# Altium project Sayma_AMC.PrjPcb (part 15 of 18)

## Sheet FPGA_Decoupling.SchDoc: Sayma AMC
size 420 x 297 mm; $$Internal___BlkDate: 0:12:25_2-9-18; $$Internal_NAME_PLACEHOLDER: a3sheet; $$Internal_Resolution: 00001mm; $$NotCommonProperty_@NAME: FPGA_XCKU040FFVA1156; $$NotCommonProperty_@PRINTORDER: 24; $$NotCommonProperty_@SHEET: FPGA Decoupling; $$NotCommonProperty_@SHEETTOTAL: 30; CmpIndex: 996; Drawing Author: G.Kasprowicz; Drawing Number: Sayma AMC; Drawing Project: AMC FMC Carrier Board; Drawing Revision: 2.0; SymIndex: 2141; CheckedBy: P.Kulik,T.Przywozki,W.Ruclo; Author: G.Kasprowicz; CompanyName: WUT ISE; DrawnBy: G.Kasprowicz; Organization: WUT ISE; Address1: PW ISE; Address2: Nowowiejska 15/19 00-665 Warsaw; Address3: gkasprow@gmail.com; DocumentNumber: 30; Revision: 2; SheetNumber: 30; SheetTotal: 32; ModifiedBy: -; CheckedDate: -; Title2: FPGA Decoupling; DivGrp: WUT ISE; Designer: G.Kasprowicz; ModifiedDate: -; ProjectName: Sensor Box
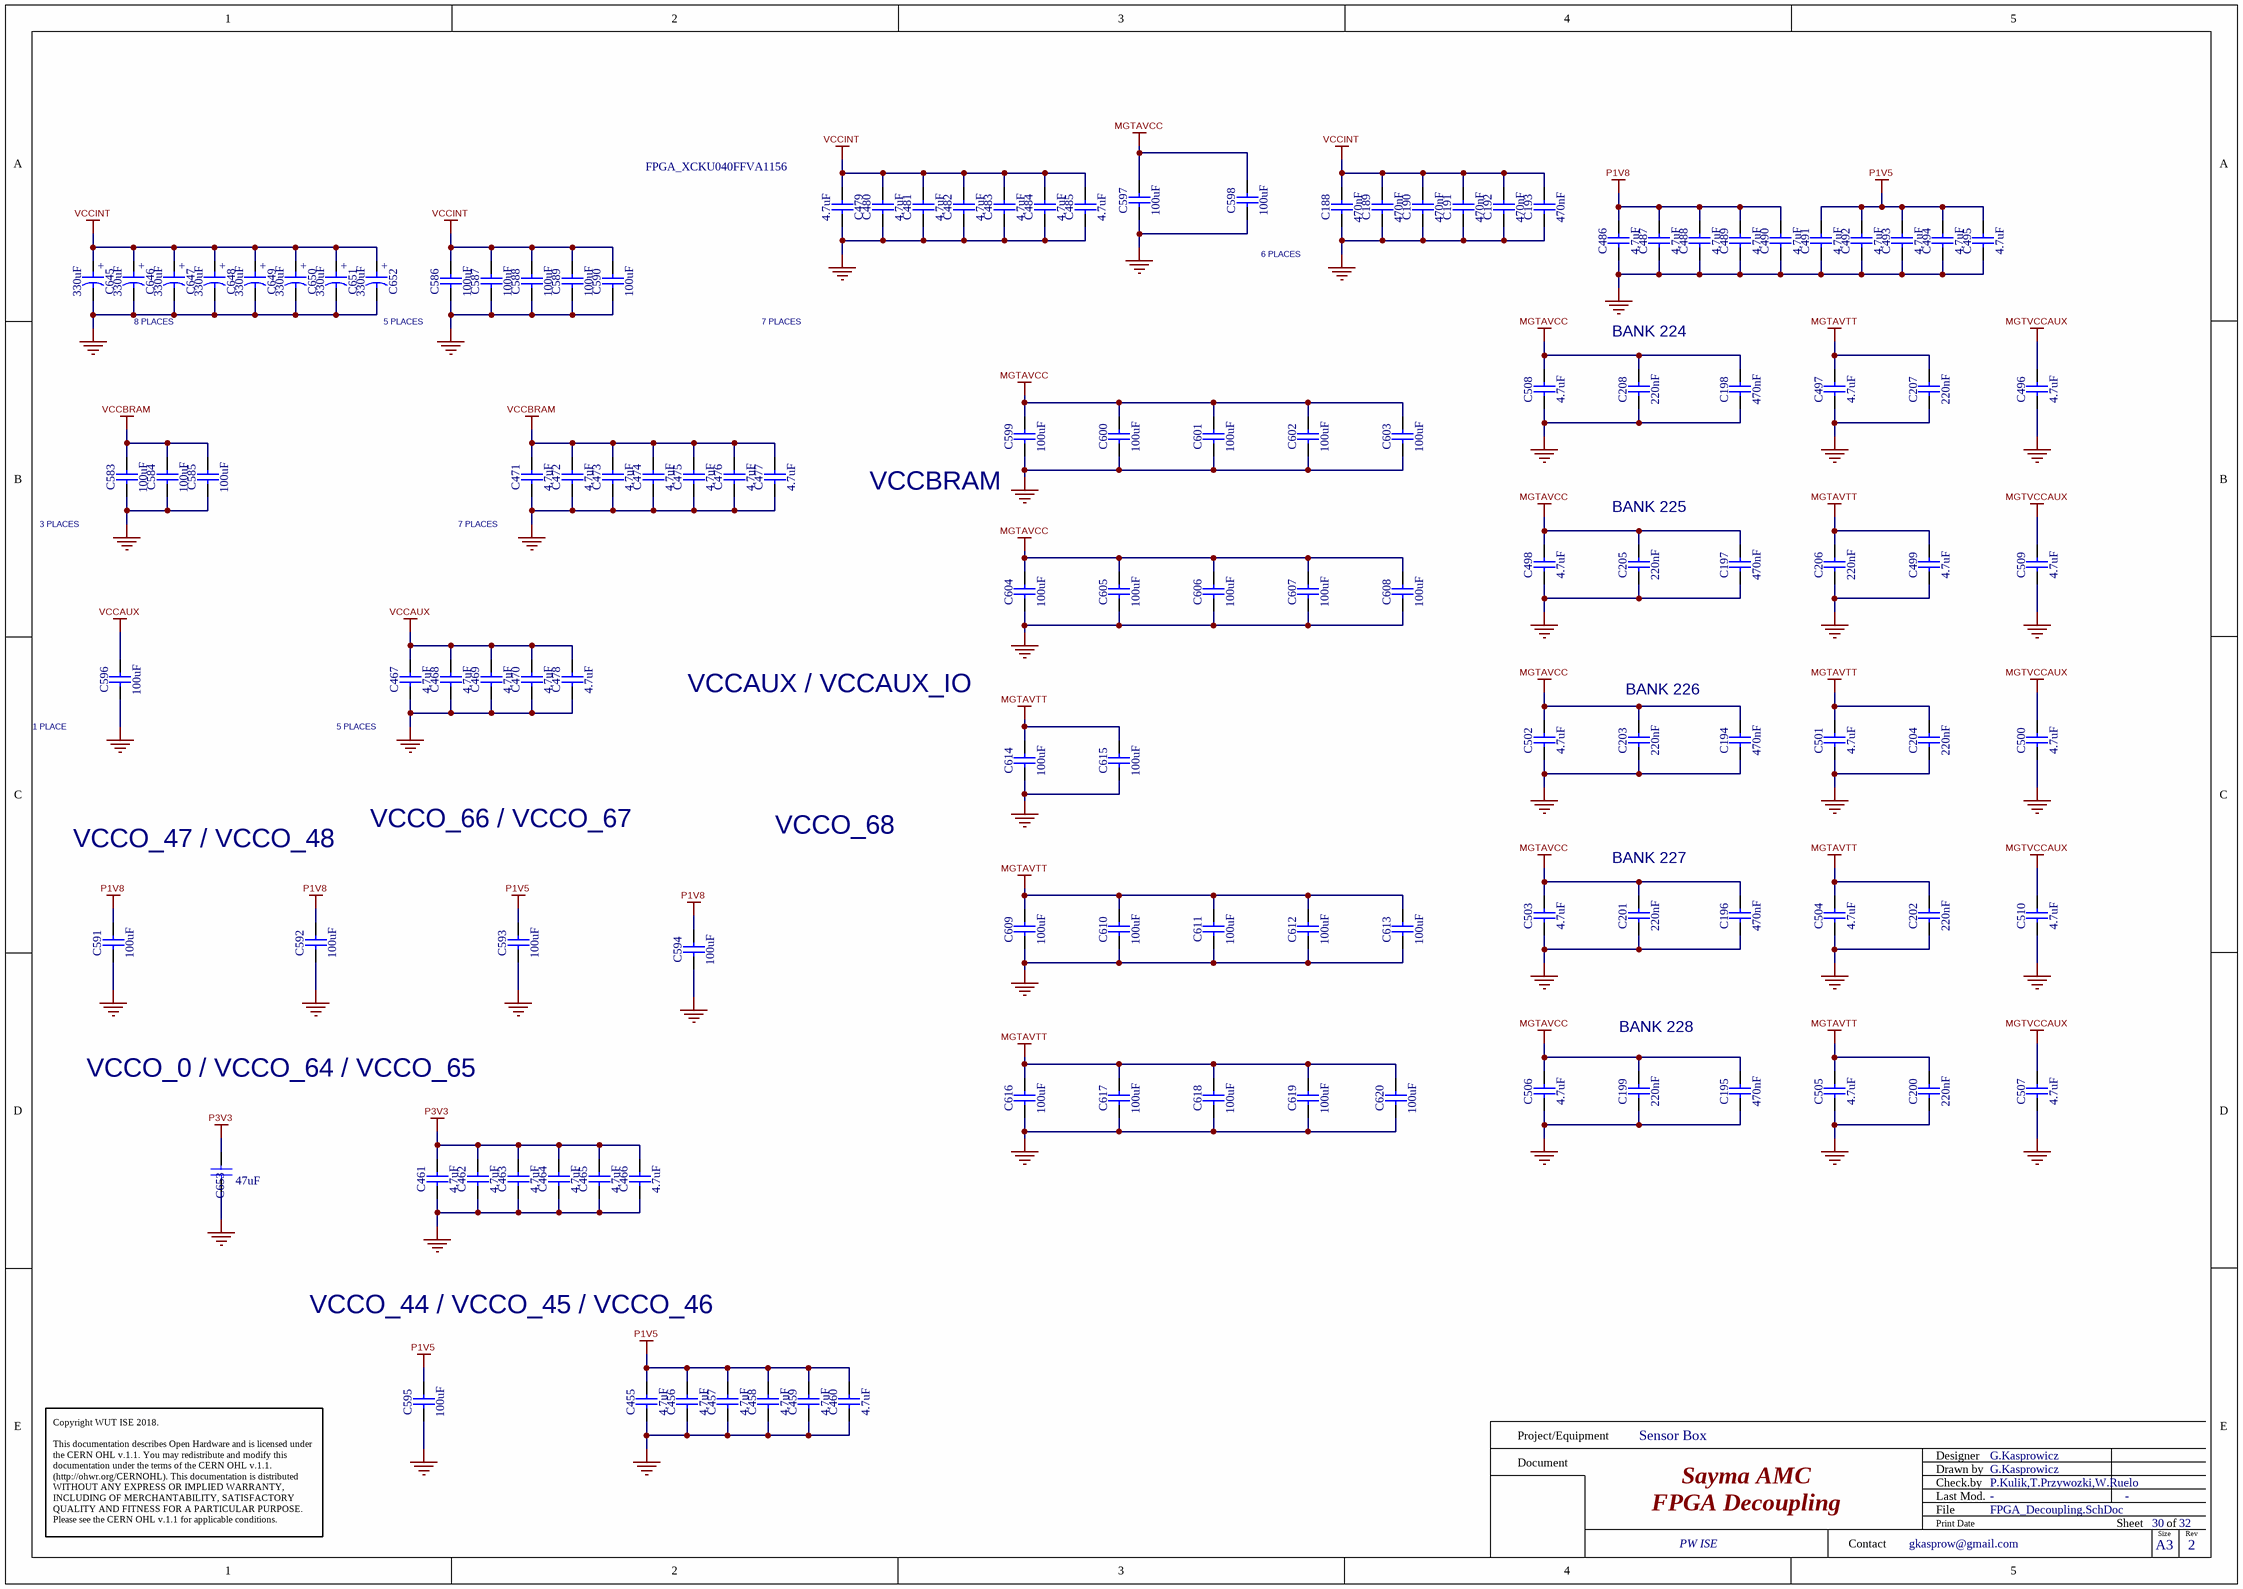
[diagram p26: FPGA_Decoupling.SchDoc]

### Parts
C188  470nF  [CAPC0603X33N]
C189  470nF  [CAPC0603X33N]
C190  470nF  [CAPC0603X33N]
C191  470nF  [CAPC0603X33N]
C192  470nF  [CAPC0603X33N]
C193  470nF  [CAPC0603X33N]
C194  470nF  [CAPC0603X33N]
C195  470nF  [CAPC0603X33N]
C196  470nF  [CAPC0603X33N]
C197  470nF  [CAPC0603X33N]
C198  470nF  [CAPC0603X33N]
C199  220nF  [CAPC0603X33N]
C200  220nF  [CAPC0603X33N]
C201  220nF  [CAPC0603X33N]
C202  220nF  [CAPC0603X33N]
C203  220nF  [CAPC0603X33N]
C204  220nF  [CAPC0603X33N]
C205  220nF  [CAPC0603X33N]
C206  220nF  [CAPC0603X33N]
C207  220nF  [CAPC0603X33N]
C208  220nF  [CAPC0603X33N]
C455  4.7uF  [CAPC1005X55N]
C456  4.7uF  [CAPC1005X55N]
C457  4.7uF  [CAPC1005X55N]
C458  4.7uF  [CAPC1005X55N]
C459  4.7uF  [CAPC1005X55N]
C460  4.7uF  [CAPC1005X55N]
C461  4.7uF  [CAPC1005X55N]
C462  4.7uF  [CAPC1005X55N]
C463  4.7uF  [CAPC1005X55N]
C464  4.7uF  [CAPC1005X55N]
C465  4.7uF  [CAPC1005X55N]
C466  4.7uF  [CAPC1005X55N]
C467  4.7uF  [CAPC1005X55N]
C468  4.7uF  [CAPC1005X55N]
C469  4.7uF  [CAPC1005X55N]
C470  4.7uF  [CAPC1005X55N]
C471  4.7uF  [CAPC1005X55N]
C472  4.7uF  [CAPC1005X55N]
C473  4.7uF  [CAPC1005X55N]
C474  4.7uF  [CAPC1005X55N]
C475  4.7uF  [CAPC1005X55N]
C476  4.7uF  [CAPC1005X55N]
C477  4.7uF  [CAPC1005X55N]
C478  4.7uF  [CAPC1005X55N]
C479  4.7uF  [CAPC1005X55N]
C480  4.7uF  [CAPC1005X55N]
C481  4.7uF  [CAPC1005X55N]
C482  4.7uF  [CAPC1005X55N]
C483  4.7uF  [CAPC1005X55N]
C484  4.7uF  [CAPC1005X55N]
C485  4.7uF  [CAPC1005X55N]
C486  4.7uF  [CAPC1005X55N]
C487  4.7uF  [CAPC1005X55N]
C488  4.7uF  [CAPC1005X55N]
C489  4.7uF  [CAPC1005X55N]
C490  4.7uF  [CAPC1005X55N]
C491  4.7uF  [CAPC1005X55N]
C492  4.7uF  [CAPC1005X55N]
C493  4.7uF  [CAPC1005X55N]
C494  4.7uF  [CAPC1005X55N]
C495  4.7uF  [CAPC1005X55N]
C496  4.7uF  [CAPC1005X55N]
C497  4.7uF  [CAPC1005X55N]
C498  4.7uF  [CAPC1005X55N]
C499  4.7uF  [CAPC1005X55N]
C500  4.7uF  [CAPC1005X55N]
C501  4.7uF  [CAPC1005X55N]
C502  4.7uF  [CAPC1005X55N]
C503  4.7uF  [CAPC1005X55N]
C504  4.7uF  [CAPC1005X55N]
C505  4.7uF  [CAPC1005X55N]
C506  4.7uF  [CAPC1005X55N]
C507  4.7uF  [CAPC1005X55N]
C508  4.7uF  [CAPC1005X55N]
C509  4.7uF  [CAPC1005X55N]
C510  4.7uF  [CAPC1005X55N]
C583  100uF  [CAPC3216X180N]
C584  100uF  [CAPC3216X180N]
C585  100uF  [CAPC3216X180N]
C586  100uF  [CAPC3216X180N]
C587  100uF  [CAPC3216X180N]
C588  100uF  [CAPC3216X180N]
C589  100uF  [CAPC3216X180N]
C590  100uF  [CAPC3216X180N]
C591  100uF  [CAPC3216X180N]
C592  100uF  [CAPC3216X180N]
C593  100uF  [CAPC3216X180N]
C594  100uF  [CAPC3216X180N]
C595  100uF  [CAPC3216X180N]
C596  100uF  [CAPC3216X180N]
C597  100uF  [CAPC3216X180N]
C598  100uF  [CAPC3216X180N]
C599  100uF  [CAPC3216X180N]
C600  100uF  [CAPC3216X180N]
C601  100uF  [CAPC3216X180N]
C602  100uF  [CAPC3216X180N]
C603  100uF  [CAPC3216X180N]
C604  100uF  [CAPC3216X180N]
C605  100uF  [CAPC3216X180N]
C606  100uF  [CAPC3216X180N]
C607  100uF  [CAPC3216X180N]
C608  100uF  [CAPC3216X180N]
C609  100uF  [CAPC3216X180N]
C610  100uF  [CAPC3216X180N]
C611  100uF  [CAPC3216X180N]
C612  100uF  [CAPC3216X180N]
C613  100uF  [CAPC3216X180N]
C614  100uF  [CAPC3216X180N]
C615  100uF  [CAPC3216X180N]
C616  100uF  [CAPC3216X180N]
C617  100uF  [CAPC3216X180N]
C618  100uF  [CAPC3216X180N]
C619  100uF  [CAPC3216X180N]
C620  100uF  [CAPC3216X180N]
C645  330uF  [CAPMP3528X210N]
C646  330uF  [CAPMP3528X210N]
C647  330uF  [CAPMP3528X210N]
C648  330uF  [CAPMP3528X210N]
C649  330uF  [CAPMP3528X210N]
C650  330uF  [CAPMP3528X210N]
C651  330uF  [CAPMP3528X210N]
C652  330uF  [CAPMP3528X210N]
C653  47uF  [CAPC3225X270N]

### Nets
GND: C188.1 C189.1 C190.1 C191.1 C192.1 C193.1 C194.1 C195.1 C196.1 C197.1 C198.1 C199.1 C200.1 C201.1 C202.1 C203.1 C204.1 C205.1 C206.1 C207.1 C208.1 C455.1 C456.1 C457.1 C458.1 C459.1 C460.1 C461.1 C462.1 C463.1 C464.1 C465.1 C466.1 C467.1 C468.1 C469.1 C470.1 C471.1 C472.1 C473.1 C474.1 C475.1 C476.1 C477.1 C478.1 C479.1 C480.1 C481.1 C482.1 C483.1 C484.1 C485.1 C486.1 C487.1 C488.1 C489.1 C490.1 C491.1 C492.1 C493.1 C494.1 C495.1 C496.1 C497.1 C498.1 C499.1 C500.1 C501.1 C502.1 C503.1 C504.1 C505.1 C506.1 C507.1 C508.1 C509.1 C510.1 C583.1 C584.1 C585.1 C586.1 C587.1 C588.1 C589.1 C590.1 C591.1 C592.1 C593.1 C594.1 C595.1 C596.1 C597.1 C598.1 C599.1 C600.1 C601.1 C602.1 C603.1 C604.1 C605.1 C606.1 C607.1 C608.1 C609.1 C610.1 C611.1 C612.1 C613.1 C614.1 C615.1 C616.1 C617.1 C618.1 C619.1 C620.1 C645.2 C646.2 C647.2 C648.2 C649.2 C650.2 C651.2 C652.2 C653.1
MGTAVCC: C194.2 C195.2 C196.2 C197.2 C198.2 C199.2 C201.2 C203.2 C205.2 C208.2 C498.2 C502.2 C503.2 C506.2 C508.2 C597.2 C598.2 C599.2 C600.2 C601.2 C602.2 C603.2 C604.2 C605.2 C606.2 C607.2 C608.2
MGTAVTT: C200.2 C202.2 C204.2 C206.2 C207.2 C497.2 C499.2 C501.2 C504.2 C505.2 C609.2 C610.2 C611.2 C612.2 C613.2 C614.2 C615.2 C616.2 C617.2 C618.2 C619.2 C620.2
MGTVCCAUX: C496.2 C500.2 C507.2 C509.2 C510.2
P1V5: C455.2 C456.2 C457.2 C458.2 C459.2 C460.2 C491.2 C492.2 C493.2 C494.2 C495.2 C593.2 C595.2
P1V8: C486.2 C487.2 C488.2 C489.2 C490.2 C591.2 C592.2 C594.2
P3V3: C461.2 C462.2 C463.2 C464.2 C465.2 C466.2 C653.2
VCCAUX: C467.2 C468.2 C469.2 C470.2 C478.2 C596.2
VCCBRAM: C471.2 C472.2 C473.2 C474.2 C475.2 C476.2 C477.2 C583.2 C584.2 C585.2
VCCINT: C188.2 C189.2 C190.2 C191.2 C192.2 C193.2 C479.2 C480.2 C481.2 C482.2 C483.2 C484.2 C485.2 C586.2 C587.2 C588.2 C589.2 C590.2 C645.1 C646.1 C647.1 C648.1 C649.1 C650.1 C651.1 C652.1

### Notes on the sheet
- 6 PLACES
- 8 PLACES
- 5 PLACES
- 7 PLACES
- (near C208) BANK 224
- 3 PLACES
- VCCBRAM
- (near C205) BANK 225
- 1 PLACE
- VCCAUX / VCCAUX_IO
- (near C203) BANK 226
- VCCO_47 / VCCO_48
- VCCO_66 / VCCO_67
- VCCO_68
- (near C201) BANK 227
- (near C199) BANK 228
- VCCO_0 / VCCO_64 / VCCO_65
- VCCO_44 / VCCO_45 / VCCO_46
- Project/Equipment
- Document
- Designer
- Drawn by
- Check.by
- Copyright WUT ISE 2018.
  This documentation describes Open Hardware and is licensed under the CERN OHL v.1.1. You may redistribute and modify this documentation under the terms of the CERN OHL v.1.1. (http://ohwr.org/CERNOHL). This documentation is distributed WITHOUT ANY EXPRESS OR IMPLIED WARRANTY, INCLUDING OF MERCHANTABILITY, SATISFACTORY QUALITY AND FITNESS FOR A PARTICULAR PURPOSE. Please see the CERN OHL v.1.1 for applicable conditions.
- Contact
- File
- Last Mod.
- Print Date
- Sheet
- Size
- A3
- of
- Rev
- (in symbol CTE3528-21_330UF_2.5V_20%_LESR0015_KEMET_T520) +

### Library data of the parts
C188-C198 = CC0201_470NF_4V_20%_X5R: Non-polarised capacitor; Manufacturer: GENERIC; Part Description: SMD Multilayer Chip Ceramic Capacitor; Manufacturer1 Part Number: AMK063BJ474MP-F; Tolerance: ±20%; Voltage: 4V; TC: X5R; Manufacturer Part Number: CC0201_470NF_4V_20%_X5R; Part Number: CC0201_470NF_4V_20%_X5R; Value: 470nF; Component Kind: Standard; Component Type: Standard; Pin Count: 2; Status: Not Recommended; Case: 0201; Mounted: Yes; Socket: No; SMD: Yes; Sense: No; Manufacturer1 Example: TAIYO YUDEN; Manufacturer1 ComponentHeight: 0.33mm; HelpURL: \\cern.ch\dfs\Applications\Altium\Datasheets\CC0201_X5R_TAIYO-YUDEN_STANDARD-CLASS2.pdf; Author: CERN DEM JLC; CreateDate: 27.05.2010; LatestRevisionDate: 27.05.2010
C199-C208 = CC0201_220NF_6.3V_20%_X5R: Non-polarised capacitor; Manufacturer: GENERIC; Part Description: SMD Multilayer Chip Ceramic Capacitor; Manufacturer1 Part Number: JMK063BJ224MP-F; Tolerance: ±20%; Voltage: 6.3V; TC: X5R; Manufacturer Part Number: CC0201_220NF_6.3V_20%_X5R; Part Number: CC0201_220NF_6.3V_20%_X5R; Value: 220nF; Component Kind: Standard; Component Type: Standard; Pin Count: 2; Status: Not Recommended; Case: 0201; Mounted: Yes; Socket: No; SMD: Yes; Sense: No; Manufacturer1 Example: TAIYO YUDEN; Manufacturer1 ComponentHeight: 0.33mm; HelpURL: \\cern.ch\dfs\Applications\Altium\Datasheets\CC0201_X5R_TAIYO-YUDEN_STANDARD-CLASS2.pdf; Author: CERN DEM JLC; CreateDate: 27.05.2010; LatestRevisionDate: 27.05.2010
C455-C510 = CC0402_4.7UF_6.3V_20%_X5R: Non-polarised capacitor; Manufacturer: GENERIC; Part Description: SMD Multilayer Chip Ceramic Capacitor; Manufacturer1 Part Number: C1005X5R0J475M050BC; Tolerance: ±20%; Voltage: 6.3V; TC: X5R; Manufacturer Part Number: CC0402_4.7UF_6.3V_20%_X5R; Part Number: CC0402_4.7UF_6.3V_20%_X5R; Value: 4.7uF; Component Kind: Standard; Component Type: Standard; Pin Count: 2; Status: Preferred; Case: 0402; Mounted: Yes; Socket: No; SMD: Yes; Sense: No; Manufacturer1 Example: TDK; Manufacturer1 ComponentHeight: 0.65mm; HelpURL: \\cern.ch\dfs\Applications\Altium\Datasheets\CC0402_X5R_TDK_C.pdf; Author: CERN DEM JLC; CreateDate: 03.03.2015; LatestRevisionDate: 03.03.2015
C583-C620 = CC1206_100UF_6.3V_20%_X5R: Non-polarised capacitor; Manufacturer: GENERIC; Part Description: SMD Multilayer Chip Ceramic Capacitor; Manufacturer1 Part Number: C1206C107M9PACTU; Tolerance: ±10%; Voltage: 6.3V; TC: X5R; Manufacturer Part Number: CC1206_100UF_6.3V_20%_X5R; Part Number: CC1206_100UF_6.3V_20%_X5R; Value: 100uF; Component Kind: Standard; Component Type: Standard; Pin Count: 2; Status: None; Case: 1206; Mounted: Yes; Socket: No; SMD: Yes; Sense: No; Manufacturer1 Example: KEMET; Manufacturer1 ComponentHeight: 1.8mm; HelpURL: \\cern.ch\dfs\Applications\Altium\Datasheets\CC1206_X5R_KEMET.pdf; Author: CERN DEM JLC; CreateDate: 26.09.2012; LatestRevisionDate: 26.09.2012
C645-C652 = CTE3528-21_330UF_2.5V_20%_LESR0015_KEMET_T520: Polarised capacitor; Manufacturer Part Number: T520B337M2R5ATE015; Manufacturer: KEMET; Part Description: Low ESR 0R015 Tantalum Chip Capacitor; Tolerance: ±20%; Voltage: 2.5V; Part Number: CTE3528-21_330UF_2.5V_20%_LESR0015_KEMET_T520; Value: 330uF; Component Kind: Standard; Component Type: Standard; Pin Count: 2; Status: None; Case: B; Mounted: Yes; Socket: No; SMD: Yes; Sense: No; ComponentHeight: 2.1mm; HelpURL: \\cern.ch\dfs\Applications\Altium\Datasheets\CTE-LESR_KEMET_T520.pdf; Author: CERN DEM JLC; CreateDate: 07.03.2012; LatestRevisionDate: 01.09.2014
C653 = CAPC3225X270N: $$NotCommonProperty_General Part Number: CC1210_47UF_6.3V_10%_X5R; $$NotCommonProperty_Manufacturer1 Example: AVX; $$NotCommonProperty_Manufacturer1 Part Number: 12106D476KAT2A; Manufacturer: GENERIC; Part Description: SMD Multilayer Chip Ceramic Capacitor; Part Name: Capacitor - non polarized CAPC3225X270N; $$Internal_Resolution: 00001mm; $$NotCommonProperty_Case: 1210; $$NotCommonProperty_Pin Count: 2; $$NotCommonProperty_SMD: Yes; $$NotCommonProperty_Status: Preferred; $$NotCommonProperty_TC: X5R; $$NotCommonProperty_Voltage: 6.3V; CmpIndex: 876; DXDB_LIBNAME: Capacitors SMD; Ref Designator: C653; SymIndex: 331; Tolerance: ±10%; Cell Name: CAPC3225X270N; Manufacturer Part Number: CC1210_47UF_6.3V_10%_X5R; Part Number: Capacitor - non polarized CAPC3225X270N; Value: 47uF; Orientation: 1 = 1

## Sheet FPGA_GND_NC.SchDoc: Sayma AMC
size 420 x 297 mm; $$Internal___BlkDate: 0:12:25_2-9-18; $$Internal_NAME_PLACEHOLDER: a3sheet; $$Internal_Resolution: 00001mm; $$NotCommonProperty_@NAME: FPGA_XCKU040FFVA1156; $$NotCommonProperty_@PRINTORDER: 23; $$NotCommonProperty_@SHEET: FPGA GND NC; $$NotCommonProperty_@SHEETTOTAL: 30; CmpIndex: 995; Drawing Author: G.Kasprowicz; Drawing Number: Sayma AMC; Drawing Project: AMC FMC Carrier Board; Drawing Revision: 2.0; SymIndex: 2141; CheckedBy: P.Kulik,T.Przywozki,W.Ruclo; Author: G.Kasprowicz; CompanyName: WUT ISE; DrawnBy: G.Kasprowicz; Organization: WUT ISE; Address1: PW ISE; Address2: Nowowiejska 15/19 00-665 Warsaw; Address3: gkasprow@gmail.com; DocumentNumber: 31; Revision: 2; SheetNumber: 31; SheetTotal: 32; ModifiedBy: -; CheckedDate: -; Title2: FPGA power ports; DivGrp: WUT ISE; Designer: G.Kasprowicz; ModifiedDate: -; ProjectName: Sensor Box
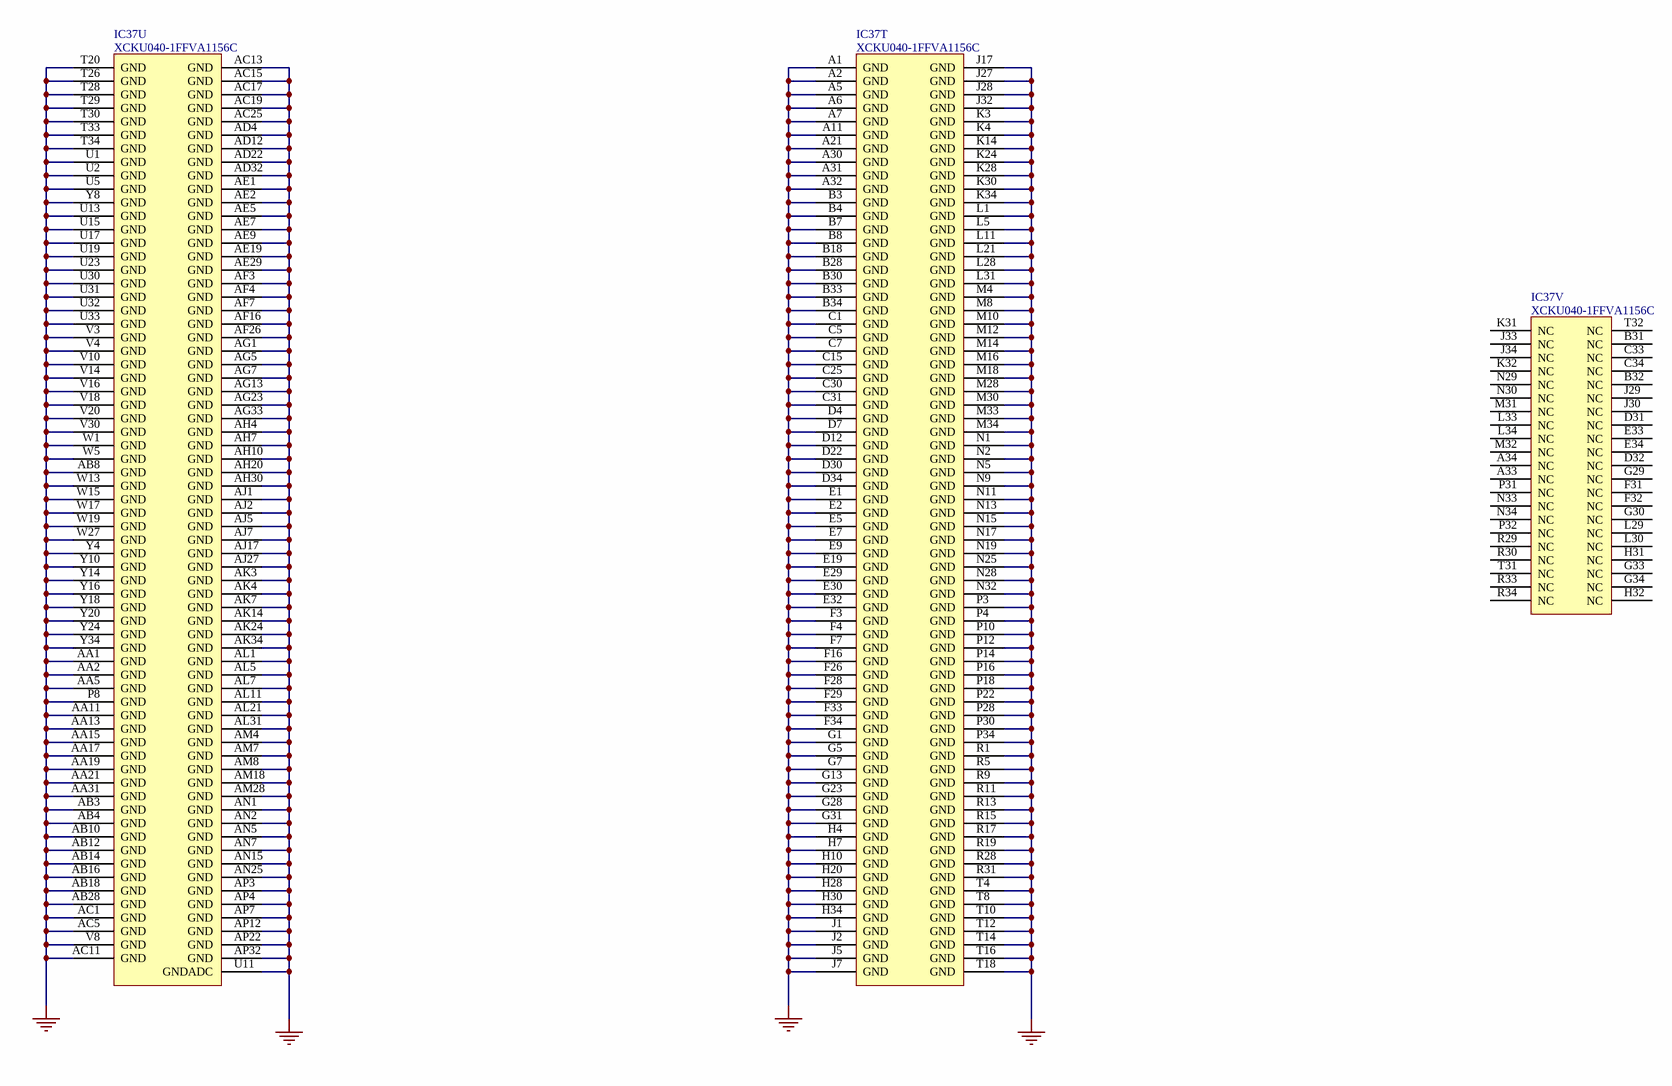
[diagram p27: FPGA_GND_NC.SchDoc]

### Parts
IC37  XCKU040-1FFVA1156C  [BGA1156C100P34X34_3500X3500X350]  (parts T,U,V of 22)

### Nets
GND: IC37.A1(GND) IC37.A2(GND) IC37.A5(GND) IC37.A6(GND) IC37.A7(GND) IC37.A11(GND) IC37.A21(GND) IC37.A30(GND) IC37.A31(GND) IC37.A32(GND) IC37.AA1(GND) IC37.AA2(GND) IC37.AA5(GND) IC37.AA11(GND) IC37.AA13(GND) IC37.AA15(GND) IC37.AA17(GND) IC37.AA19(GND) IC37.AA21(GND) IC37.AA31(GND) IC37.AB3(GND) IC37.AB4(GND) IC37.AB8(GND) IC37.AB10(GND) IC37.AB12(GND) IC37.AB14(GND) IC37.AB16(GND) IC37.AB18(GND) IC37.AB28(GND) IC37.AC1(GND) IC37.AC5(GND) IC37.AC11(GND) IC37.AC13(GND) IC37.AC15(GND) IC37.AC17(GND) IC37.AC19(GND) IC37.AC25(GND) IC37.AD4(GND) IC37.AD12(GND) IC37.AD22(GND) IC37.AD32(GND) IC37.AE1(GND) IC37.AE2(GND) IC37.AE5(GND) IC37.AE7(GND) IC37.AE9(GND) IC37.AE19(GND) IC37.AE29(GND) IC37.AF3(GND) IC37.AF4(GND) IC37.AF7(GND) IC37.AF16(GND) IC37.AF26(GND) IC37.AG1(GND) IC37.AG5(GND) IC37.AG7(GND) IC37.AG13(GND) IC37.AG23(GND) IC37.AG33(GND) IC37.AH4(GND) IC37.AH7(GND) IC37.AH10(GND) IC37.AH20(GND) IC37.AH30(GND) IC37.AJ1(GND) IC37.AJ2(GND) IC37.AJ5(GND) IC37.AJ7(GND) IC37.AJ17(GND) IC37.AJ27(GND) IC37.AK3(GND) IC37.AK4(GND) IC37.AK7(GND) IC37.AK14(GND) IC37.AK24(GND) IC37.AK34(GND) IC37.AL1(GND) IC37.AL5(GND) IC37.AL7(GND) IC37.AL11(GND) IC37.AL21(GND) IC37.AL31(GND) IC37.AM4(GND) IC37.AM7(GND) IC37.AM8(GND) IC37.AM18(GND) IC37.AM28(GND) IC37.AN1(GND) IC37.AN2(GND) IC37.AN5(GND) IC37.AN7(GND) IC37.AN15(GND) IC37.AN25(GND) IC37.AP3(GND) IC37.AP4(GND) IC37.AP7(GND) IC37.AP12(GND) IC37.AP22(GND) IC37.AP32(GND) IC37.B3(GND) IC37.B4(GND) IC37.B7(GND) IC37.B8(GND) IC37.B18(GND) IC37.B28(GND) IC37.B30(GND) IC37.B33(GND) IC37.B34(GND) IC37.C1(GND) IC37.C5(GND) IC37.C7(GND) IC37.C15(GND) IC37.C25(GND) IC37.C30(GND) IC37.C31(GND) IC37.D4(GND) IC37.D7(GND) IC37.D12(GND) IC37.D22(GND) IC37.D30(GND) IC37.D34(GND) IC37.E1(GND) IC37.E2(GND) IC37.E5(GND) IC37.E7(GND) IC37.E9(GND) IC37.E19(GND) IC37.E29(GND) IC37.E30(GND) IC37.E32(GND) IC37.F3(GND) IC37.F4(GND) IC37.F7(GND) IC37.F16(GND) IC37.F26(GND) IC37.F28(GND) IC37.F29(GND) IC37.F33(GND) IC37.F34(GND) IC37.G1(GND) IC37.G5(GND) IC37.G7(GND) IC37.G13(GND) IC37.G23(GND) IC37.G28(GND) IC37.G31(GND) IC37.H4(GND) IC37.H7(GND) IC37.H10(GND) IC37.H20(GND) IC37.H28(GND) IC37.H30(GND) IC37.H34(GND) IC37.J1(GND) IC37.J2(GND) IC37.J5(GND) IC37.J7(GND) IC37.J17(GND) IC37.J27(GND) IC37.J28(GND) IC37.J32(GND) IC37.K3(GND) IC37.K4(GND) IC37.K14(GND) IC37.K24(GND) IC37.K28(GND) IC37.K30(GND) IC37.K34(GND) IC37.L1(GND) IC37.L5(GND) IC37.L11(GND) IC37.L21(GND) IC37.L28(GND) IC37.L31(GND) IC37.M4(GND) IC37.M8(GND) IC37.M10(GND) IC37.M12(GND) IC37.M14(GND) IC37.M16(GND) IC37.M18(GND) IC37.M28(GND) IC37.M30(GND) IC37.M33(GND) IC37.M34(GND) IC37.N1(GND) IC37.N2(GND) IC37.N5(GND) IC37.N9(GND) IC37.N11(GND) IC37.N13(GND) IC37.N15(GND) IC37.N17(GND) IC37.N19(GND) IC37.N25(GND) IC37.N28(GND) IC37.N32(GND) IC37.P3(GND) IC37.P4(GND) IC37.P8(GND) IC37.P10(GND) IC37.P12(GND) IC37.P14(GND) IC37.P16(GND) IC37.P18(GND) IC37.P22(GND) IC37.P28(GND) IC37.P30(GND) IC37.P34(GND) IC37.R1(GND) IC37.R5(GND) IC37.R9(GND) IC37.R11(GND) IC37.R13(GND) IC37.R15(GND) IC37.R17(GND) IC37.R19(GND) IC37.R28(GND) IC37.R31(GND) IC37.T4(GND) IC37.T8(GND) IC37.T10(GND) IC37.T12(GND) IC37.T14(GND) IC37.T16(GND) IC37.T18(GND) IC37.T20(GND) IC37.T26(GND) IC37.T28(GND) IC37.T29(GND) IC37.T30(GND) IC37.T33(GND) IC37.T34(GND) IC37.U1(GND) IC37.U2(GND) IC37.U5(GND) IC37.U11(GNDADC) IC37.U13(GND) IC37.U15(GND) IC37.U17(GND) IC37.U19(GND) IC37.U23(GND) IC37.U30(GND) IC37.U31(GND) IC37.U32(GND) IC37.U33(GND) IC37.V3(GND) IC37.V4(GND) IC37.V8(GND) IC37.V10(GND) IC37.V14(GND) IC37.V16(GND) IC37.V18(GND) IC37.V20(GND) IC37.V30(GND) IC37.W1(GND) IC37.W5(GND) IC37.W13(GND) IC37.W15(GND) IC37.W17(GND) IC37.W19(GND) IC37.W27(GND) IC37.Y4(GND) IC37.Y8(GND) IC37.Y10(GND) IC37.Y14(GND) IC37.Y16(GND) IC37.Y18(GND) IC37.Y20(GND) IC37.Y24(GND) IC37.Y34(GND)

Not connected (* = marked no-connect by the designer): IC37 A33(NC) A34(NC) B31(NC) B32(NC) C33(NC) C34(NC) D31(NC) D32(NC) E33(NC) E34(NC) F31(NC) F32(NC) G29(NC) G30(NC) G33(NC) G34(NC) H31(NC) H32(NC) J29(NC) J30(NC) J33(NC) J34(NC) K31(NC) K32(NC) L29(NC) L30(NC) L33(NC) L34(NC) M31(NC) M32(NC) N29(NC) N30(NC) N33(NC) N34(NC) P31(NC) P32(NC) R29(NC) R30(NC) R33(NC) R34(NC) T31(NC) T32(NC)

### Notes on the sheet
- Project/Equipment
- Document
- Designer
- Drawn by
- Check.by
- Copyright WUT ISE 2018.
  This documentation describes Open Hardware and is licensed under the CERN OHL v.1.1. You may redistribute and modify this documentation under the terms of the CERN OHL v.1.1. (http://ohwr.org/CERNOHL). This documentation is distributed WITHOUT ANY EXPRESS OR IMPLIED WARRANTY, INCLUDING OF MERCHANTABILITY, SATISFACTORY QUALITY AND FITNESS FOR A PARTICULAR PURPOSE. Please see the CERN OHL v.1.1 for applicable conditions.
- Contact
- File
- Last Mod.
- Print Date
- Sheet
- Size
- A3
- of
- Rev

### Library data of the parts
IC37 = XCKU040-1FFVA1156C: Kintex UltraScale FPGA, 520 I/O, 530K Cells, 1156-Ball BGA, Speed Grade 1, Commercial Grade; Manufacturer: XILINX; Part Description: Kintex UltraScale, 40 DLL I/O, 416 HP I/O, 104 HR I/O, 1156-Pin BGA, Speed Grade 1, Commercial Grade; PressFit: No; Bonding: No; Manufacturer Part Number: XCKU040-1FFVA1156C; PackageDescription: BGA, 1.00mm Pitch, Square; 1156 Pin, 34 Columns X 34 Rows, Body 35.00mm X 35.00mm X 3.50mm H, IPC Medium Density; Part Number: XCKU040-1FFVA1156C; Component Kind: Standard; Component Type: Standard; Device: XCKU040-1FFVA1156C; Pin Count: 1156; Case: BGA1156; Mounted: Yes; Socket: No; SMD: Yes; Sense: No; ComponentHeight: 3.5mm; HelpURL: \\cern.ch\dfs\Applications\Altium\Datasheets\XCKU040-1FFVA1156C.pdf; ComponentLink1URL: \\cern.ch\dfs\Applications\Altium\Datasheets\XCKU040-1FFVA1156C_Package-Pinout.pdf; ComponentLink1Description: Package/Pinout; Author: CERN DEM CA; CreateDate: 16.08.2016; LatestRevisionDate: 16.08.2016

## Sheet FPGA_Bank_66_HP.SchDoc: Sayma AMC
size 420 x 297 mm; $$Internal___BlkDate: 0:12:25_2-9-18; $$Internal_NAME_PLACEHOLDER: a3sheet; $$Internal_Resolution: 00001mm; $$NotCommonProperty_@NAME: FPGA_XCKU040FFVA1156; $$NotCommonProperty_@PRINTORDER: 20; $$NotCommonProperty_@SHEET: FPGA Bank 66 HP; $$NotCommonProperty_@SHEETTOTAL: 30; CmpIndex: 992; Drawing Author: G.Kasprowicz; Drawing Number: Sayma AMC; Drawing Project: AMC FMC Carrier Board; Drawing Revision: 2.0; SymIndex: 2141; CheckedBy: P.Kulik,T.Przywozki,W.Ruclo; Author: G.Kasprowicz; CompanyName: WUT ISE; DrawnBy: G.Kasprowicz; Organization: WUT ISE; Address1: PW ISE; Address2: Nowowiejska 15/19 00-665 Warsaw; Address3: gkasprow@gmail.com; DocumentNumber: 22; Revision: 2; SheetNumber: 22; SheetTotal: 32; ModifiedBy: -; CheckedDate: -; Title2: FPGA bank 66 (RTM LVDS); DivGrp: WUT ISE; Designer: G.Kasprowicz; ModifiedDate: -; ProjectName: Sensor Box
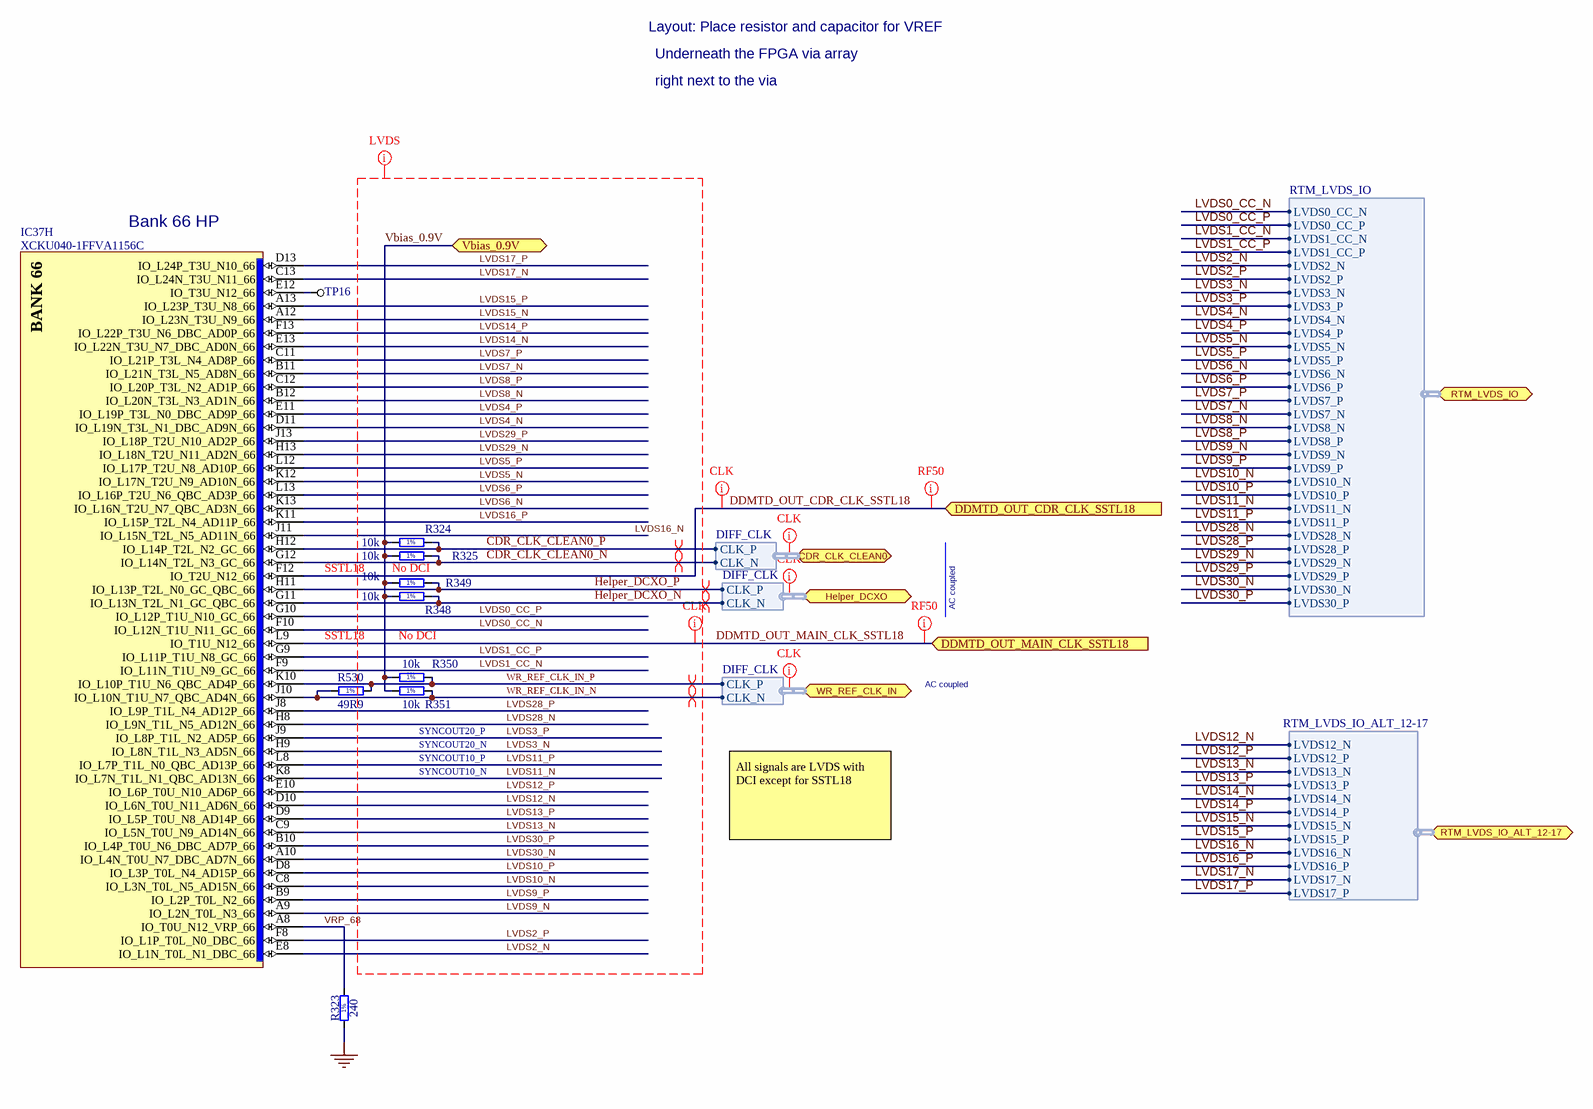
[diagram p28: FPGA_Bank_66_HP.SchDoc]

### Parts
IC37  XCKU040-1FFVA1156C  [BGA1156C100P34X34_3500X3500X350]  (part H of 22)
R323  240  [RESC1005X40N]
R324  10k  [RESC1005X40N]
R325  10k  [RESC1005X40N]
R348  10k  [RESC1005X40N]
R349  10k  [RESC1005X40N]
R350  10k  [RESC1005X40N]
R351  10k  [RESC1005X40N]
R530  49R9  [RESC1005X40N]
TP16  TP  [TP]  (value not drawn)

### Ports
CDR_CLK_CLEAN0 (bidir, harness DIFF_CLK), DDMTD_OUT_CDR_CLK_SSTL18 (in), DDMTD_OUT_MAIN_CLK_SSTL18 (in), Helper_DCXO (bidir, harness DIFF_CLK), RTM_LVDS_IO (bidir, harness RTM_LVDS_IO), RTM_LVDS_IO_ALT_12-17 (bidir, harness RTM_LVDS_IO_ALT_12-17), Vbias_0.9V (bidir), WR_REF_CLK_IN (bidir, harness DIFF_CLK)

### Harnesses
RTM_LVDS_IO: LVDS0_CC_N, LVDS0_CC_P, LVDS1_CC_N, LVDS1_CC_P, LVDS2_N, LVDS2_P, LVDS3_N, LVDS3_P, LVDS4_N, LVDS4_P, LVDS5_N, LVDS5_P, LVDS6_N, LVDS6_P, LVDS7_P, LVDS7_N, LVDS8_N, LVDS8_P, LVDS9_N, LVDS9_P, LVDS10_N, LVDS10_P, LVDS11_N, LVDS11_P, LVDS28_N, LVDS28_P, LVDS29_N, LVDS29_P, LVDS30_N, LVDS30_P
RTM_LVDS_IO_ALT_12-17: LVDS12_N, LVDS12_P, LVDS13_N, LVDS13_P, LVDS14_N, LVDS14_P, LVDS15_N, LVDS15_P, LVDS16_N, LVDS16_P, LVDS17_N, LVDS17_P
DIFF_CLK: CLK_N, CLK_P

### Nets
GND: R323.1
CDR_CLK_CLEAN0_N: IC37.G12(IO_L14N_T2L_N3_GC_66) R325.2 ; port CDR_CLK_CLEAN0.CLK_N
CDR_CLK_CLEAN0_P: IC37.H12(IO_L14P_T2L_N2_GC_66) R324.2 ; port CDR_CLK_CLEAN0.CLK_P
DDMTD_OUT_CDR_CLK_SSTL18: IC37.F12(IO_T2U_N12_66) ; port DDMTD_OUT_CDR_CLK_SSTL18
DDMTD_OUT_MAIN_CLK_SSTL18: IC37.L9(IO_T1U_N12_66) ; port DDMTD_OUT_MAIN_CLK_SSTL18
Helper_DCXO_N: IC37.G11(IO_L13N_T2L_N1_GC_QBC_66) R349.2 ; port Helper_DCXO.CLK_N
Helper_DCXO_P: IC37.H11(IO_L13P_T2L_N0_GC_QBC_66) R348.2 ; port Helper_DCXO.CLK_P
LVDS0_CC_N: IC37.F10(IO_L12N_T1U_N11_GC_66) ; port RTM_LVDS_IO.LVDS0_CC_N
LVDS0_CC_P: IC37.G10(IO_L12P_T1U_N10_GC_66) ; port RTM_LVDS_IO.LVDS0_CC_P
LVDS1_CC_N: IC37.F9(IO_L11N_T1U_N9_GC_66) ; port RTM_LVDS_IO.LVDS1_CC_N
LVDS1_CC_P: IC37.G9(IO_L11P_T1U_N8_GC_66) ; port RTM_LVDS_IO.LVDS1_CC_P
LVDS2_N: IC37.E8(IO_L1N_T0L_N1_DBC_66) ; port RTM_LVDS_IO.LVDS2_N
LVDS2_P: IC37.F8(IO_L1P_T0L_N0_DBC_66) ; port RTM_LVDS_IO.LVDS2_P
LVDS3_N: IC37.H9(IO_L8N_T1L_N3_AD5N_66) ; port RTM_LVDS_IO.LVDS3_N
LVDS3_P: IC37.J9(IO_L8P_T1L_N2_AD5P_66) ; port RTM_LVDS_IO.LVDS3_P
LVDS4_N: IC37.D11(IO_L19N_T3L_N1_DBC_AD9N_66) ; port RTM_LVDS_IO.LVDS4_N
LVDS4_P: IC37.E11(IO_L19P_T3L_N0_DBC_AD9P_66) ; port RTM_LVDS_IO.LVDS4_P
LVDS5_N: IC37.K12(IO_L17N_T2U_N9_AD10N_66) ; port RTM_LVDS_IO.LVDS5_N
LVDS5_P: IC37.L12(IO_L17P_T2U_N8_AD10P_66) ; port RTM_LVDS_IO.LVDS5_P
LVDS6_N: IC37.K13(IO_L16N_T2U_N7_QBC_AD3N_66) ; port RTM_LVDS_IO.LVDS6_N
LVDS6_P: IC37.L13(IO_L16P_T2U_N6_QBC_AD3P_66) ; port RTM_LVDS_IO.LVDS6_P
LVDS7_N: IC37.B11(IO_L21N_T3L_N5_AD8N_66) ; port RTM_LVDS_IO.LVDS7_N
LVDS7_P: IC37.C11(IO_L21P_T3L_N4_AD8P_66) ; port RTM_LVDS_IO.LVDS7_P
LVDS8_N: IC37.B12(IO_L20N_T3L_N3_AD1N_66) ; port RTM_LVDS_IO.LVDS8_N
LVDS8_P: IC37.C12(IO_L20P_T3L_N2_AD1P_66) ; port RTM_LVDS_IO.LVDS8_P
LVDS9_N: IC37.A9(IO_L2N_T0L_N3_66) ; port RTM_LVDS_IO.LVDS9_N
LVDS9_P: IC37.B9(IO_L2P_T0L_N2_66) ; port RTM_LVDS_IO.LVDS9_P
LVDS10_N: IC37.C8(IO_L3N_T0L_N5_AD15N_66) ; port RTM_LVDS_IO.LVDS10_N
LVDS10_P: IC37.D8(IO_L3P_T0L_N4_AD15P_66) ; port RTM_LVDS_IO.LVDS10_P
LVDS11_N: IC37.K8(IO_L7N_T1L_N1_QBC_AD13N_66) ; port RTM_LVDS_IO.LVDS11_N
LVDS11_P: IC37.L8(IO_L7P_T1L_N0_QBC_AD13P_66) ; port RTM_LVDS_IO.LVDS11_P
LVDS12_N: IC37.D10(IO_L6N_T0U_N11_AD6N_66) ; port RTM_LVDS_IO_ALT_12-17.LVDS12_N
LVDS12_P: IC37.E10(IO_L6P_T0U_N10_AD6P_66) ; port RTM_LVDS_IO_ALT_12-17.LVDS12_P
LVDS13_N: IC37.C9(IO_L5N_T0U_N9_AD14N_66) ; port RTM_LVDS_IO_ALT_12-17.LVDS13_N
LVDS13_P: IC37.D9(IO_L5P_T0U_N8_AD14P_66) ; port RTM_LVDS_IO_ALT_12-17.LVDS13_P
LVDS14_N: IC37.E13(IO_L22N_T3U_N7_DBC_AD0N_66) ; port RTM_LVDS_IO_ALT_12-17.LVDS14_N
LVDS14_P: IC37.F13(IO_L22P_T3U_N6_DBC_AD0P_66) ; port RTM_LVDS_IO_ALT_12-17.LVDS14_P
LVDS15_N: IC37.A12(IO_L23N_T3U_N9_66) ; port RTM_LVDS_IO_ALT_12-17.LVDS15_N
LVDS15_P: IC37.A13(IO_L23P_T3U_N8_66) ; port RTM_LVDS_IO_ALT_12-17.LVDS15_P
LVDS16_N: IC37.J11(IO_L15N_T2L_N5_AD11N_66) ; port RTM_LVDS_IO_ALT_12-17.LVDS16_N
LVDS16_P: IC37.K11(IO_L15P_T2L_N4_AD11P_66) ; port RTM_LVDS_IO_ALT_12-17.LVDS16_P
LVDS17_N: IC37.C13(IO_L24N_T3U_N11_66) ; port RTM_LVDS_IO_ALT_12-17.LVDS17_N
LVDS17_P: IC37.D13(IO_L24P_T3U_N10_66) ; port RTM_LVDS_IO_ALT_12-17.LVDS17_P
LVDS28_N: IC37.H8(IO_L9N_T1L_N5_AD12N_66) ; port RTM_LVDS_IO.LVDS28_N
LVDS28_P: IC37.J8(IO_L9P_T1L_N4_AD12P_66) ; port RTM_LVDS_IO.LVDS28_P
LVDS29_N: IC37.H13(IO_L18N_T2U_N11_AD2N_66) ; port RTM_LVDS_IO.LVDS29_N
LVDS29_P: IC37.J13(IO_L18P_T2U_N10_AD2P_66) ; port RTM_LVDS_IO.LVDS29_P
LVDS30_N: IC37.A10(IO_L4N_T0U_N7_DBC_AD7N_66) ; port RTM_LVDS_IO.LVDS30_N
LVDS30_P: IC37.B10(IO_L4P_T0U_N6_DBC_AD7P_66) ; port RTM_LVDS_IO.LVDS30_P
Vbias_0.9V: R324.1 R325.1 R348.1 R349.1 R350.1 R351.1 ; port Vbias_0.9V
VRP_68: IC37.A8(IO_T0U_N12_VRP_66) R323.2
WR_REF_CLK_IN_N: IC37.J10(IO_L10N_T1U_N7_QBC_AD4N_66) R351.2 R530.1 ; port WR_REF_CLK_IN.CLK_N
WR_REF_CLK_IN_P: IC37.K10(IO_L10P_T1U_N6_QBC_AD4P_66) R350.2 R530.2 ; port WR_REF_CLK_IN.CLK_P
NetIC37_E12: IC37.E12(IO_T3U_N12_66) TP16.1

### Layout directives
net class LVDS: CDR_CLK_CLEAN0_N, CDR_CLK_CLEAN0_P, Helper_DCXO_N, Helper_DCXO_P, LVDS0_CC_N, LVDS0_CC_P, LVDS1_CC_N, LVDS1_CC_P, LVDS2_N, LVDS2_P, LVDS3_N, LVDS3_P, LVDS4_N, LVDS4_P, LVDS5_N, LVDS5_P, LVDS6_N, LVDS6_P, LVDS7_N, LVDS7_P, LVDS8_N, LVDS8_P, LVDS9_N, LVDS9_P, LVDS10_N, LVDS10_P, LVDS11_N, LVDS11_P, LVDS12_N, LVDS12_P, LVDS13_N, LVDS13_P, LVDS14_N, LVDS14_P, LVDS15_N, LVDS15_P, LVDS16_N, LVDS16_P, LVDS17_N, LVDS17_P, LVDS28_N, LVDS28_P, LVDS29_N, LVDS29_P, LVDS30_N, LVDS30_P, Vbias_0.9V, WR_REF_CLK_IN_N, WR_REF_CLK_IN_P
differential pair: CDR_CLK_CLEAN0_N, CDR_CLK_CLEAN0_P, Helper_DCXO_N, Helper_DCXO_P, WR_REF_CLK_IN_N, WR_REF_CLK_IN_P
net class RF50: DDMTD_OUT_CDR_CLK_SSTL18, DDMTD_OUT_MAIN_CLK_SSTL18
net class CLK: (no net found under the mark), DDMTD_OUT_CDR_CLK_SSTL18, DDMTD_OUT_MAIN_CLK_SSTL18

### Notes on the sheet
- Layout: Place resistor and capacitor for VREF
- Underneath the FPGA via array
- right next to the via
- Bank 66 HP
- SSTL18
- No DCI
- AC coupled
- SYNCOUT20_P
- SYNCOUT20_N
- SYNCOUT10_P
- SYNCOUT10_N
- All signals are LVDS with DCI except for SSTL18
- Project/Equipment
- Document
- Designer
- Drawn by
- Check.by
- Copyright WUT ISE 2018.
  This documentation describes Open Hardware and is licensed under the CERN OHL v.1.1. You may redistribute and modify this documentation under the terms of the CERN OHL v.1.1. (http://ohwr.org/CERNOHL). This documentation is distributed WITHOUT ANY EXPRESS OR IMPLIED WARRANTY, INCLUDING OF MERCHANTABILITY, SATISFACTORY QUALITY AND FITNESS FOR A PARTICULAR PURPOSE. Please see the CERN OHL v.1.1 for applicable conditions.
- Contact
- File
- Last Mod.
- Print Date
- Sheet
- Size
- A3
- of
- Rev
- (in symbol R0402_10K_1%_0.0625W_100PPM) 1%
- (in symbol R0402_49R9_1%_0.0625W_100PPM) 1%
- (in symbol R0402_240R_1%_0.0625W_100PPM) 1%
- (in symbol XCKU040-1FFVA1156C, part H) BANK 66

### Library data of the parts
IC37 = XCKU040-1FFVA1156C: as IC37 on sheet FPGA_GND_NC; PackageDescription: BGA, 1.00mm Pitch, Square; 1156 Pin, 34 Columns X 34 Rows, Body 35.00mm X 35.00mm X 3.50mm H, IPC Medium Density; Part Number: XCKU040-1FFVA1156C; Component Kind: Standard; Component Type: Standard; Device: XCKU040-1FFVA1156C; Manufacturer Part Number: XCKU040-1FFVA1156C; Pin Count: 1156; Case: BGA1156; Mounted: Yes; Socket: No; SMD: Yes; Sense: No; ComponentHeight: 3.5mm; HelpURL: \\cern.ch\dfs\Applications\Altium\Datasheets\XCKU040-1FFVA1156C.pdf; ComponentLink1URL: \\cern.ch\dfs\Applications\Altium\Datasheets\XCKU040-1FFVA1156C_Package-Pinout.pdf; ComponentLink1Description: Package/Pinout; Author: CERN DEM CA; CreateDate: 16.08.2016; LatestRevisionDate: 16.08.2016
R323 = R0402_240R_1%_0.0625W_100PPM: Resistor - 1%; Manufacturer: GENERIC; Part Description: General Purpose Thick Film Chip Resistor; Manufacturer1 Part Number: 232270672401L; TC: ±100ppm/°C; PressFit: No; Manufacturer Part Number: R0402_240R_1%_0.0625W_100PPM; Part Number: R0402_240R_1%_0.0625W_100PPM; Tolerance: ±1%; Value: 240; Component Kind: Standard; Component Type: Standard; Pin Count: 2; Status: Not Recommended; Power: 0.0625W; Case: 0402; Mounted: Yes; Sense: No; Socket: No; SMD: Yes; Manufacturer1 Example: YAGEO PHYCOMP; Manufacturer1 ComponentHeight: 0.4mm; HelpURL: \\cern.ch\dfs\Applications\Altium\Datasheets\R0402_Phycomp_RC0402.pdf; Author: CERN DEM JLC; CreateDate: 03.12.2007; LatestRevisionDate: 17.10.2012
R324 R325 R348-R351 = R0402_10K_1%_0.0625W_100PPM: Resistor - 1%; Manufacturer: GENERIC; Part Description: General Purpose Thick Film Chip Resistor; Manufacturer1 Part Number: 232270671003L; TC: ±100ppm/°C; PressFit: No; Manufacturer Part Number: R0402_10K_1%_0.0625W_100PPM; Part Number: R0402_10K_1%_0.0625W_100PPM; Tolerance: ±1%; Value: 10k; Component Kind: Standard; Component Type: Standard; Pin Count: 2; Status: Not Recommended; Power: 0.0625W; Case: 0402; Mounted: Yes; Sense: No; Socket: No; SMD: Yes; Manufacturer1 Example: YAGEO PHYCOMP; Manufacturer1 ComponentHeight: 0.4mm; HelpURL: \\cern.ch\dfs\Applications\Altium\Datasheets\R0402_Phycomp_RC0402.pdf; Author: CERN DEM JLC; CreateDate: 03.12.2007; LatestRevisionDate: 17.10.2012
R530 = R0402_49R9_1%_0.0625W_100PPM: Resistor - 1%; Manufacturer: GENERIC; Part Description: General Purpose Thick Film Chip Resistor; Manufacturer1 Part Number: 232270674999L or RC0402FR-0749R9L; TC: ±100ppm/°C; PressFit: No; Manufacturer Part Number: R0402_49R9_1%_0.0625W_100PPM; Part Number: R0402_49R9_1%_0.0625W_100PPM; Tolerance: ±1%; Value: 49R9; Component Kind: Standard; Component Type: Standard; Pin Count: 2; Status: Not Recommended; Power: 0.0625W; Case: 0402; Mounted: Yes; Sense: No; Socket: No; SMD: Yes; Manufacturer1 Example: YAGEO PHYCOMP; Manufacturer1 ComponentHeight: 0.4mm; HelpURL: \\cern.ch\dfs\Applications\Altium\Datasheets\R0402_Phycomp_RC0402.pdf; Author: CERN DEM JLC; CreateDate: 24.10.2012; LatestRevisionDate: 24.10.2012
TP16 = TP: Testpoint

## Sheet FPGA_Power.SchDoc: Sayma AMC
size 420 x 297 mm; $$Internal___BlkDate: 0:12:25_2-9-18; $$Internal_NAME_PLACEHOLDER: a3sheet; $$Internal_Resolution: 00001mm; $$NotCommonProperty_@NAME: FPGA_XCKU040FFVA1156; $$NotCommonProperty_@PRINTORDER: 22; $$NotCommonProperty_@SHEET: FPGA Power; $$NotCommonProperty_@SHEETTOTAL: 30; CmpIndex: 994; Drawing Author: G.Kasprowicz; Drawing Number: Sayma AMC; Drawing Project: AMC FMC Carrier Board; Drawing Revision: 2.0; SymIndex: 2141; CheckedBy: P.Kulik,T.Przywozki,W.Ruclo; Author: G.Kasprowicz; CompanyName: WUT ISE; DrawnBy: G.Kasprowicz; Organization: WUT ISE; Address1: PW ISE; Address2: Nowowiejska 15/19 00-665 Warsaw; Address3: gkasprow@gmail.com; DocumentNumber: 32; Revision: 2; SheetNumber: 32; SheetTotal: 32; ModifiedBy: -; CheckedDate: -; Title2: FPGA power ports; DivGrp: WUT ISE; Designer: G.Kasprowicz; ModifiedDate: -; ProjectName: Sensor Box
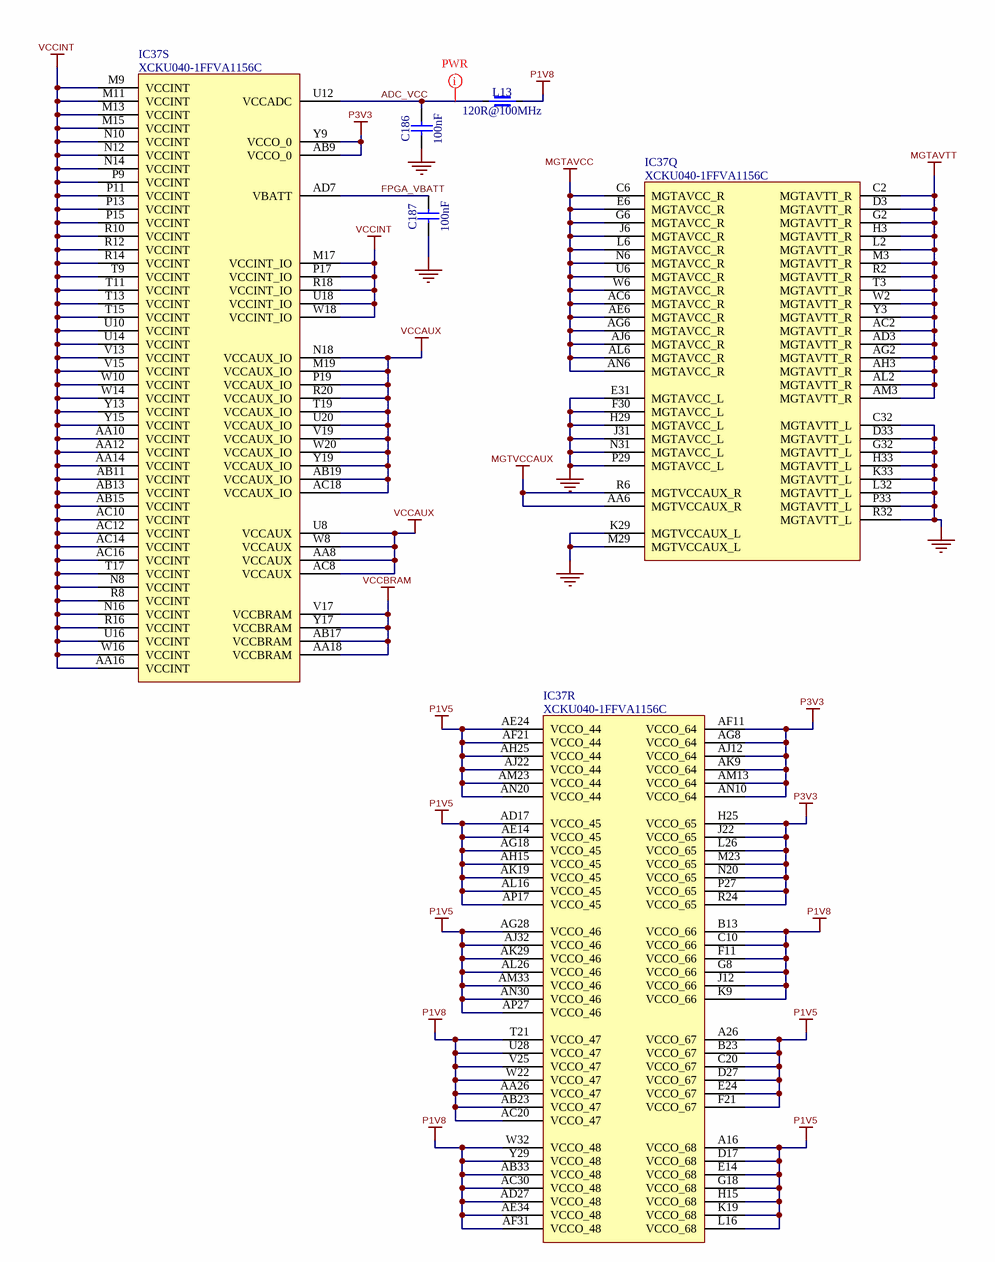
[diagram p29: FPGA_Power.SchDoc]

### Parts
C186  100nF  [CAPC0603X33N]
C187  100nF  [CAPC0603X33N]
IC37  XCKU040-1FFVA1156C  [BGA1156C100P34X34_3500X3500X350]  (parts Q,R,S of 22)
L13  120R@100MHz  [INDC1005X55N]

### Nets
GND: C186.1 C187.1 IC37.C32(MGTAVTT_L) IC37.D33(MGTAVTT_L) IC37.E31(MGTAVCC_L) IC37.F30(MGTAVCC_L) IC37.G32(MGTAVTT_L) IC37.H29(MGTAVCC_L) IC37.H33(MGTAVTT_L) IC37.J31(MGTAVCC_L) IC37.K29(MGTVCCAUX_L) IC37.K33(MGTAVTT_L) IC37.L32(MGTAVTT_L) IC37.M29(MGTVCCAUX_L) IC37.N31(MGTAVCC_L) IC37.P29(MGTAVCC_L) IC37.P33(MGTAVTT_L) IC37.R32(MGTAVTT_L)
MGTAVCC: IC37.AC6(MGTAVCC_R) IC37.AE6(MGTAVCC_R) IC37.AG6(MGTAVCC_R) IC37.AJ6(MGTAVCC_R) IC37.AL6(MGTAVCC_R) IC37.AN6(MGTAVCC_R) IC37.C6(MGTAVCC_R) IC37.E6(MGTAVCC_R) IC37.G6(MGTAVCC_R) IC37.J6(MGTAVCC_R) IC37.L6(MGTAVCC_R) IC37.N6(MGTAVCC_R) IC37.U6(MGTAVCC_R) IC37.W6(MGTAVCC_R)
MGTAVTT: IC37.AC2(MGTAVTT_R) IC37.AD3(MGTAVTT_R) IC37.AG2(MGTAVTT_R) IC37.AH3(MGTAVTT_R) IC37.AL2(MGTAVTT_R) IC37.AM3(MGTAVTT_R) IC37.C2(MGTAVTT_R) IC37.D3(MGTAVTT_R) IC37.G2(MGTAVTT_R) IC37.H3(MGTAVTT_R) IC37.L2(MGTAVTT_R) IC37.M3(MGTAVTT_R) IC37.R2(MGTAVTT_R) IC37.T3(MGTAVTT_R) IC37.W2(MGTAVTT_R) IC37.Y3(MGTAVTT_R)
MGTVCCAUX: IC37.AA6(MGTVCCAUX_R) IC37.R6(MGTVCCAUX_R)
P1V5: IC37.A16(VCCO_68) IC37.A26(VCCO_67) IC37.AD17(VCCO_45) IC37.AE14(VCCO_45) IC37.AE24(VCCO_44) IC37.AF21(VCCO_44) IC37.AG18(VCCO_45) IC37.AG28(VCCO_46) IC37.AH15(VCCO_45) IC37.AH25(VCCO_44) IC37.AJ22(VCCO_44) IC37.AJ32(VCCO_46) IC37.AK19(VCCO_45) IC37.AK29(VCCO_46) IC37.AL16(VCCO_45) IC37.AL26(VCCO_46) IC37.AM23(VCCO_44) IC37.AM33(VCCO_46) IC37.AN20(VCCO_44) IC37.AN30(VCCO_46) IC37.AP17(VCCO_45) IC37.AP27(VCCO_46) IC37.B23(VCCO_67) IC37.C20(VCCO_67) IC37.D17(VCCO_68) IC37.D27(VCCO_67) IC37.E14(VCCO_68) IC37.E24(VCCO_67) IC37.F21(VCCO_67) IC37.G18(VCCO_68) IC37.H15(VCCO_68) IC37.K19(VCCO_68) IC37.L16(VCCO_68)
P1V8: IC37.AA26(VCCO_47) IC37.AB23(VCCO_47) IC37.AB33(VCCO_48) IC37.AC20(VCCO_47) IC37.AC30(VCCO_48) IC37.AD27(VCCO_48) IC37.AE34(VCCO_48) IC37.AF31(VCCO_48) IC37.B13(VCCO_66) IC37.C10(VCCO_66) IC37.F11(VCCO_66) IC37.G8(VCCO_66) IC37.J12(VCCO_66) IC37.K9(VCCO_66) IC37.T21(VCCO_47) IC37.U28(VCCO_47) IC37.V25(VCCO_47) IC37.W22(VCCO_47) IC37.W32(VCCO_48) IC37.Y29(VCCO_48) L13.2
P3V3: IC37.AB9(VCCO_0) IC37.AF11(VCCO_64) IC37.AG8(VCCO_64) IC37.AJ12(VCCO_64) IC37.AK9(VCCO_64) IC37.AM13(VCCO_64) IC37.AN10(VCCO_64) IC37.H25(VCCO_65) IC37.J22(VCCO_65) IC37.L26(VCCO_65) IC37.M23(VCCO_65) IC37.N20(VCCO_65) IC37.P27(VCCO_65) IC37.R24(VCCO_65) IC37.Y9(VCCO_0)
VCCAUX: IC37.AA8(VCCAUX) IC37.AB19(VCCAUX_IO) IC37.AC8(VCCAUX) IC37.AC18(VCCAUX_IO) IC37.M19(VCCAUX_IO) IC37.N18(VCCAUX_IO) IC37.P19(VCCAUX_IO) IC37.R20(VCCAUX_IO) IC37.T19(VCCAUX_IO) IC37.U8(VCCAUX) IC37.U20(VCCAUX_IO) IC37.V19(VCCAUX_IO) IC37.W8(VCCAUX) IC37.W20(VCCAUX_IO) IC37.Y19(VCCAUX_IO)
VCCBRAM: IC37.AA18(VCCBRAM) IC37.AB17(VCCBRAM) IC37.V17(VCCBRAM) IC37.Y17(VCCBRAM)
VCCINT: IC37.AA10(VCCINT) IC37.AA12(VCCINT) IC37.AA14(VCCINT) IC37.AA16(VCCINT) IC37.AB11(VCCINT) IC37.AB13(VCCINT) IC37.AB15(VCCINT) IC37.AC10(VCCINT) IC37.AC12(VCCINT) IC37.AC14(VCCINT) IC37.AC16(VCCINT) IC37.M9(VCCINT) IC37.M11(VCCINT) IC37.M13(VCCINT) IC37.M15(VCCINT) IC37.M17(VCCINT_IO) IC37.N8(VCCINT) IC37.N10(VCCINT) IC37.N12(VCCINT) IC37.N14(VCCINT) IC37.N16(VCCINT) IC37.P9(VCCINT) IC37.P11(VCCINT) IC37.P13(VCCINT) IC37.P15(VCCINT) IC37.P17(VCCINT_IO) IC37.R8(VCCINT) IC37.R10(VCCINT) IC37.R12(VCCINT) IC37.R14(VCCINT) IC37.R16(VCCINT) IC37.R18(VCCINT_IO) IC37.T9(VCCINT) IC37.T11(VCCINT) IC37.T13(VCCINT) IC37.T15(VCCINT) IC37.T17(VCCINT) IC37.U10(VCCINT) IC37.U14(VCCINT) IC37.U16(VCCINT) IC37.U18(VCCINT_IO) IC37.V13(VCCINT) IC37.V15(VCCINT) IC37.W10(VCCINT) IC37.W14(VCCINT) IC37.W16(VCCINT) IC37.W18(VCCINT_IO) IC37.Y13(VCCINT) IC37.Y15(VCCINT)
ADC_VCC: C186.2 IC37.U12(VCCADC) L13.1
FPGA_VBATT: C187.2 IC37.AD7(VBATT)

### Layout directives
net class PWR: ADC_VCC

### Notes on the sheet
- Project/Equipment
- Document
- Designer
- Drawn by
- Check.by
- Copyright WUT ISE 2018.
  This documentation describes Open Hardware and is licensed under the CERN OHL v.1.1. You may redistribute and modify this documentation under the terms of the CERN OHL v.1.1. (http://ohwr.org/CERNOHL). This documentation is distributed WITHOUT ANY EXPRESS OR IMPLIED WARRANTY, INCLUDING OF MERCHANTABILITY, SATISFACTORY QUALITY AND FITNESS FOR A PARTICULAR PURPOSE. Please see the CERN OHL v.1.1 for applicable conditions.
- Contact
- File
- Last Mod.
- Print Date
- Sheet
- Size
- A3
- of
- Rev

### Library data of the parts
C186 C187 = CC0201_100NF_6.3V_10%_X5R: Non-polarised capacitor; Manufacturer: GENERIC; Part Description: SMD Multilayer Chip Ceramic Capacitor; Manufacturer1 Part Number: 02016D104KAT2A; Tolerance: ±10%; Voltage: 6.3V; TC: X5R; Manufacturer Part Number: CC0201_100NF_6.3V_10%_X5R; Part Number: CC0201_100NF_6.3V_10%_X5R; Value: 100nF; Component Kind: Standard; Component Type: Standard; Pin Count: 2; Status: Not Recommended; Case: 0201; Mounted: Yes; Socket: No; SMD: Yes; Sense: No; Manufacturer1 Example: AVX; Manufacturer1 ComponentHeight: 0.33mm; HelpURL: \\cern.ch\dfs\Applications\Altium\Datasheets\CC0201_X5R_AVX.pdf; Author: CERN DEM JLC; CreateDate: 03.12.2007; LatestRevisionDate: 03.12.2007
IC37 = XCKU040-1FFVA1156C: as IC37 on sheet FPGA_GND_NC; PackageDescription: BGA, 1.00mm Pitch, Square; 1156 Pin, 34 Columns X 34 Rows, Body 35.00mm X 35.00mm X 3.50mm H, IPC Medium Density; Part Number: XCKU040-1FFVA1156C; Component Kind: Standard; Component Type: Standard; Device: XCKU040-1FFVA1156C; Manufacturer Part Number: XCKU040-1FFVA1156C; Pin Count: 1156; Case: BGA1156; Mounted: Yes; Socket: No; SMD: Yes; Sense: No; ComponentHeight: 3.5mm; HelpURL: \\cern.ch\dfs\Applications\Altium\Datasheets\XCKU040-1FFVA1156C.pdf; ComponentLink1URL: \\cern.ch\dfs\Applications\Altium\Datasheets\XCKU040-1FFVA1156C_Package-Pinout.pdf; ComponentLink1Description: Package/Pinout; Author: CERN DEM CA; CreateDate: 16.08.2016; LatestRevisionDate: 16.08.2016
L13 = IND0402_MURATA_BLM15PX121SN1D: Manufacturer: MURATA; Part Description: SMD EMIFIL Chip Ferrite Bead; Tolerance: ±25%; Power: 2A; Resistance: 0.055R; Manufacturer Part Number: BLM15PX121SN1D; Part Number: IND0402_MURATA_BLM15PX121SN1D; Value: 120R@100MHz; Component Kind: Standard; Component Type: Standard; Pin Count: 2; Status: None; Case: 0402; Mounted: Yes; Socket: No; SMD: Yes; Sense: No; ComponentHeight: 0.55mm; HelpURL: \\cern.ch\dfs\Applications\Altium\Datasheets\IND0402_MURATA_BLM15PX.pdf; Author: CERN DEM JMW; CreateDate: 19.02.2014; LatestRevisionDate: 25.10.2018